# EAGLE design SOT23-3-SOT23-6 (EAGLE 7.3.0)
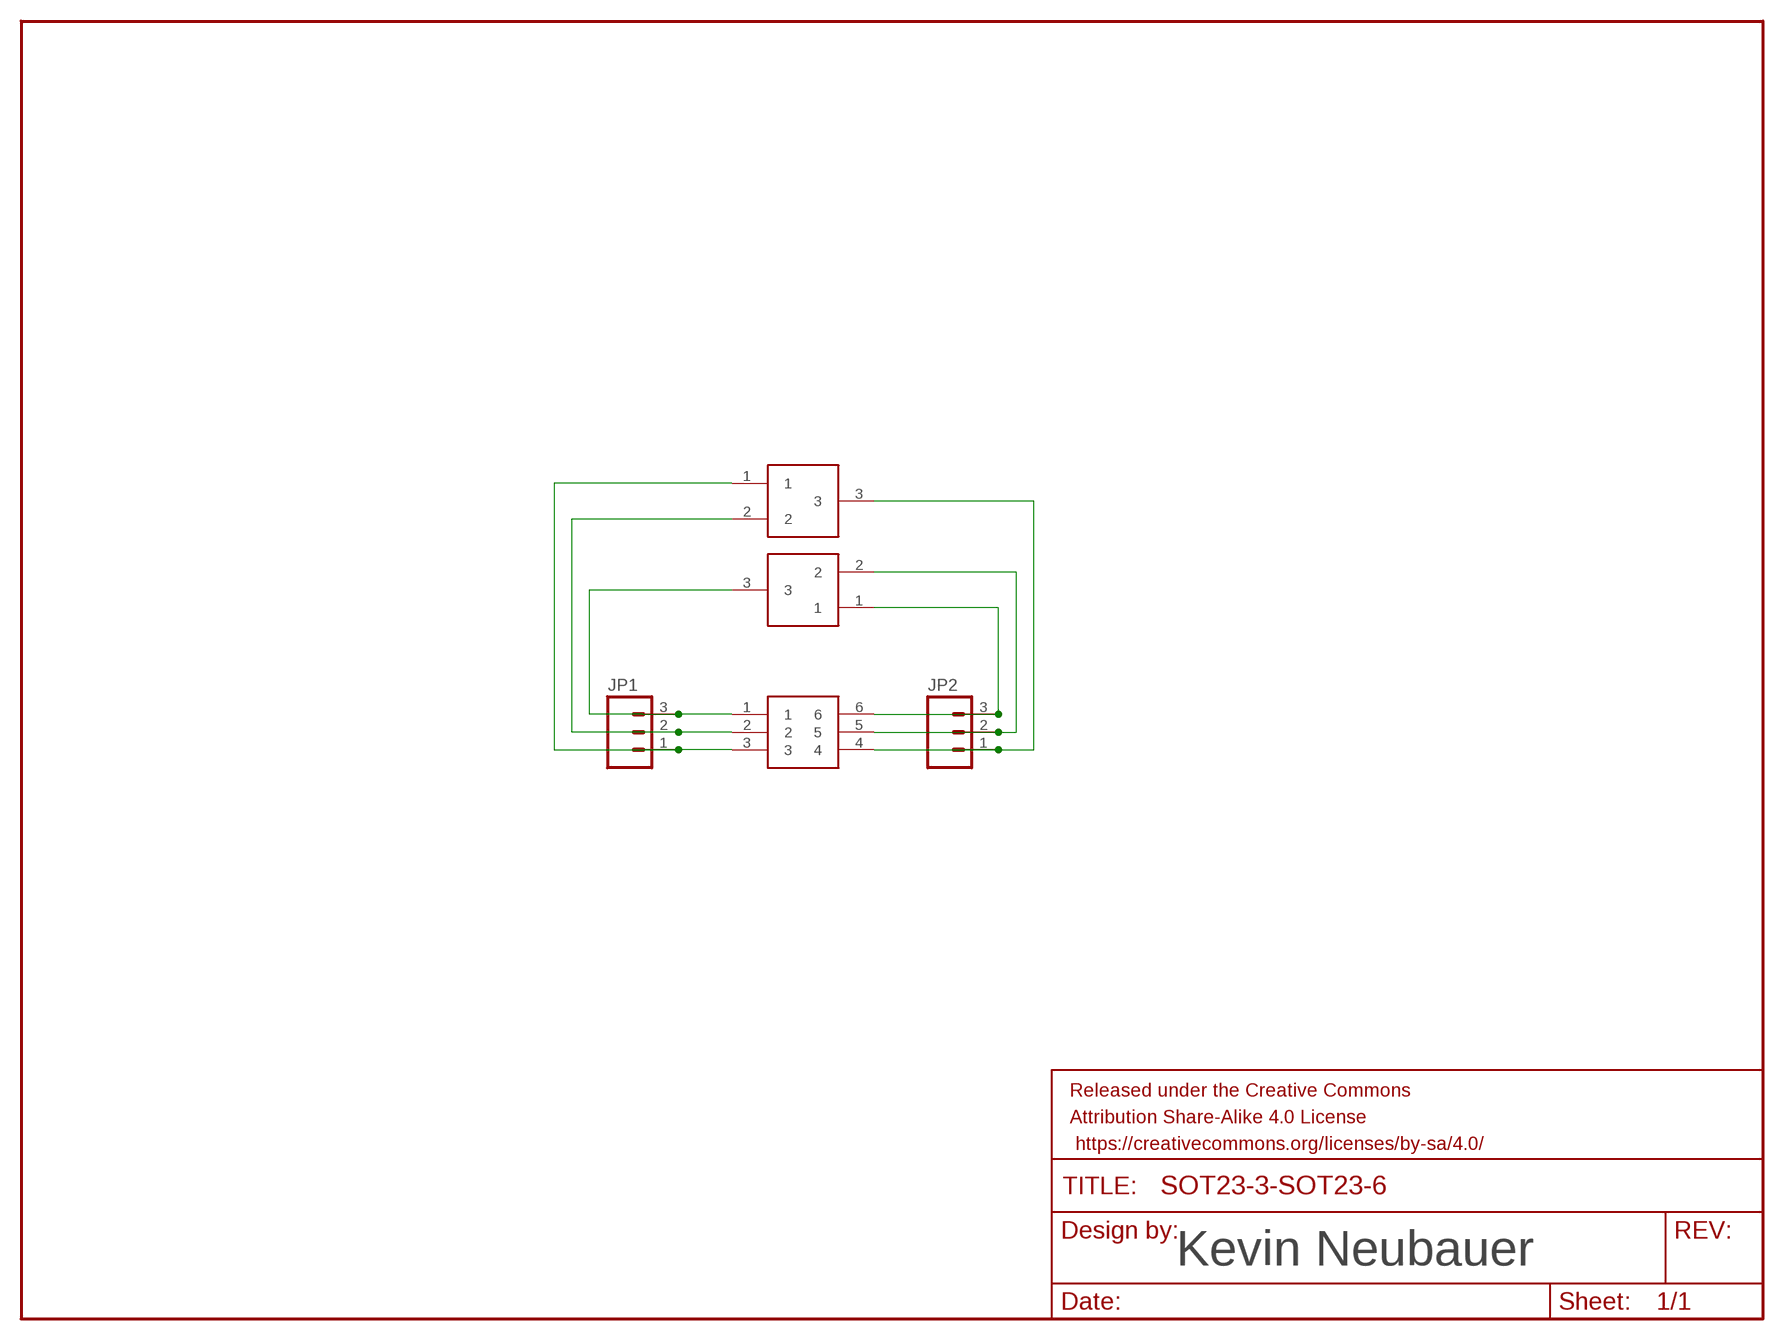
[diagram p0: schematic, sheet 1]

## Parts
FRAME1  FRAME-LETTER  [CREATIVE_COMMONS]
JP1  M03PTH  [1X03]
JP2  M03PTH  [1X03]
U$3  SOT23-3  [SOT23-3]
U$4  SOT23-3  [SOT23-3]
U$5  SOT23-6  [SOT23-6]

## Nets
N$2: JP1.2 U$3.2 U$5.2
N$3: JP1.1 U$3.1 U$5.3
N$4: JP2.3 U$4.1 U$5.6
N$5: JP2.2 U$4.2 U$5.5
N$6: JP2.1 U$3.3 U$5.4
N$7: JP1.3 U$4.3 U$5.1

## Notes on the sheet
- Kevin Neubauer

## Library data of the parts
FRAME1 = SparkFun-Aesthetics:FRAME-LETTER: Schematic Frame Standard 8.5x11 US Letter frame
JP1 JP2 = SparkFun-Connectors:M03: Header 3 Standard 3-pin 0.1" header. Use with straight break away headers (SKU : PRT-00116), right angle break away headers (PRT-00553), swiss pins (PRT-00743), machine pins (PRT-00117), and female headers (PRT-00115). Molex polarized connector foot print use with SKU : PRT-08232 with associated crimp pins and housings.
U$3 U$4 = Kevin-GenericICFootprints:SOT23-3
U$5 = Kevin-GenericICFootprints:SOT23-6

## Board
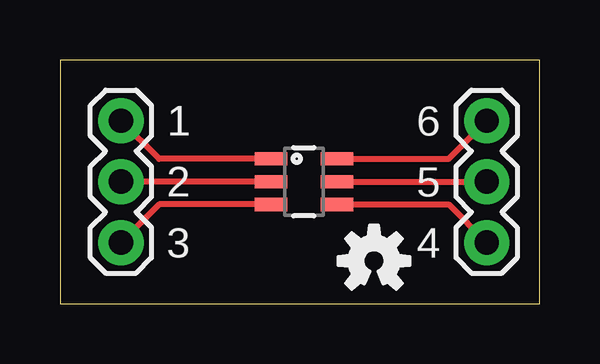
[diagram p1: board, top side]
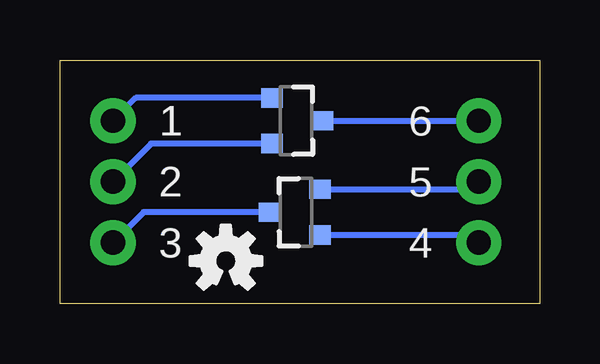
[diagram p2: board, bottom side, seen from below]

Size 19.99 x 10.15 mm. Coordinates in mm from the lower left corner, seen from the top.
Outline: 0,0 19.99,0 19.99,10.15 0,10.15 0,0
Copper layers (1*16): Top 0.035mm / dielectric 1.5mm / Bottom 0.035mm
Design rules "dirt_cheap_dirty_boards.v1": minimum track width 5mil, minimum drill 12mil, track to track 5mil, track to pad 5mil, pad to pad 5mil, via to via 5mil, smd to smd 0mil, copper to edge 10mil, drill to drill 10mil, minimum pad ring 10mil, minimum via ring 6mil, stop-mask expansion 2mil, vias tented up to drill 25mil, thermal gap 10mil

### Footprints (pad centres in the part's own frame; a part is rotated, then mirrored left to right if it is on the bottom)
1X03 = drill 1.016 pad 1.88: 1 0,0; 2 2.54,0; 3 5.08,0
SOT23-3 = smd 0.8 x 0.9: 1 -0.95,-1; 2 0.95,-1; 3 0,1.1
SOT23-6 = smd 0.55 x 1.35: 1 -0.95,-1.375; 2 0,-1.375; 3 0.95,-1.375; 4 0.95,1.375; 5 0,1.375; 6 -0.95,1.375

### Placement (x,y rotation side)
FRAME1  -6.1,-9.14 0 top  (outside the outline)
JP1  2.54,2.54 90 top
JP2  17.78,2.54 90 top
U$1  [OSHW-LOGO-S]  13.08,1.78 0 top
U$2  [OSHW-LOGO-S]  13.08,1.78 0 bottom
U$3  10.16,3.81 90 bottom
U$4  10.16,7.62 270 bottom
U$5  10.16,5.08 270 top

### Tracks (layer width: path | path; a pad name or v marks a point on that pad's centre or on a via)
N$2
  Top 0.254: U$5.2 JP1.2
  Bottom 0.254: U$3.2 2.86,4.76 JP1.2
N$3
  Top 0.254: U$5.3 4.13,4.13 JP1.1
  Bottom 0.254: U$3.1 2.86,2.86 JP1.1
N$4
  Top 0.254: U$5.6 16.19,6.03 JP2.3
  Bottom 0.254: U$4.1 16.83,8.57 JP2.3
N$5
  Top 0.254: U$5.5 JP2.2
  Bottom 0.254: U$4.2 16.19,6.67 JP2.2
N$6
  Top 0.254: U$5.4 16.19,4.13 JP2.1
  Bottom 0.254: U$3.3 16.51,3.81 JP2.1
N$7
  Top 0.254: U$5.1 4.13,6.03 JP1.3
  Bottom 0.254: U$4.3 JP1.3

### Text on the board
tPlace: 1 | 6 | 2 | 5 | 3 | 4
bPlace: 6 | 1 | 5 | 2 | 4 | 3
tDocu: Kevin Neubauer